# Altium project Counters.PrjPcb
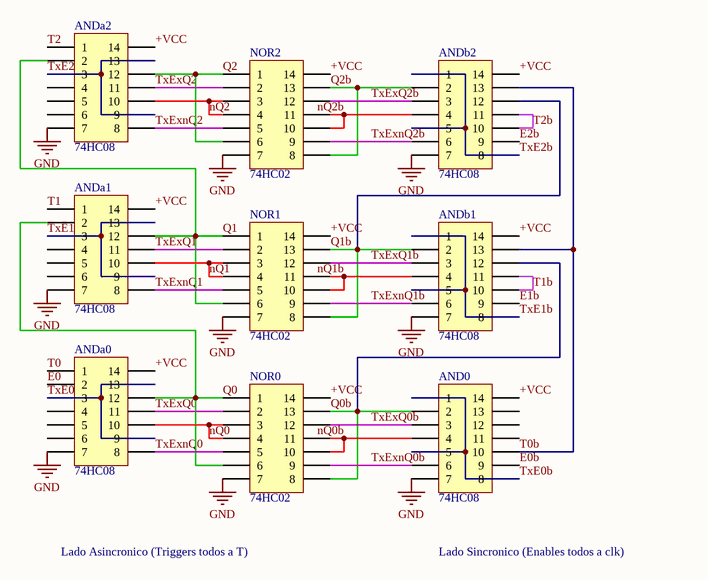
[diagram p0: Counters.SchDoc]
1 sheet, 9 parts. Net scope: global (net labels, ports and power ports of the same name join across sheets).

## Sheet Counters.SchDoc
size A

### Parts
AND0  74HC08  [DIP14]
ANDa0  74HC08  [DIP14]
ANDa1  74HC08  [DIP14]
ANDa2  74HC08  [DIP14]
ANDb1  74HC08  [DIP14]
ANDb2  74HC08  [DIP14]
NOR0  74HC02  [DIP14]
NOR1  74HC02  [DIP14]
NOR2  74HC02  [DIP14]

### Nets
GND: AND0.7 ANDa0.7 ANDa1.7 ANDa2.7 ANDb1.7 ANDb2.7 NOR0.7 NOR1.7 NOR2.7
+VCC: AND0.14 ANDa0.14 ANDa1.14 ANDa2.14 ANDb1.14 ANDb2.14 NOR0.14 NOR1.14 NOR2.14
E0: ANDa0.2
E0b: AND0.9
E1b: ANDb1.9
E2b: ANDb2.9
nQ0: ANDa0.10 NOR0.3 NOR0.4
nQ1: ANDa1.10 NOR1.3 NOR1.4
nQ2: ANDa2.10 NOR2.3 NOR2.4
Q0: ANDa0.12 ANDa1.2 NOR0.1 NOR0.6
Q0b: AND0.2 ANDb1.12 NOR0.8 NOR0.13
Q1: ANDa1.12 ANDa2.2 NOR1.1 NOR1.6
Q1b: ANDb1.2 ANDb2.12 NOR1.8 NOR1.13
Q2: ANDa2.12 NOR2.1 NOR2.6
Q2b: ANDb2.2 NOR2.8 NOR2.13
T0: ANDa0.1
T0b: AND0.10 ANDb1.13 ANDb2.13
T1: ANDa1.1
T1b: ANDb1.10 ANDb1.11
T2: ANDa2.1
T2b: ANDb2.10 ANDb2.11
TxE0: ANDa0.3 ANDa0.9 ANDa0.13
TxE0b: AND0.1 AND0.5 AND0.8
TxE1: ANDa1.3 ANDa1.9 ANDa1.13
TxE1b: ANDb1.1 ANDb1.5 ANDb1.8
TxE2: ANDa2.3 ANDa2.9 ANDa2.13
TxE2b: ANDb2.1 ANDb2.5 ANDb2.8
TxExnQ0: ANDa0.8 NOR0.5
TxExnQ0b: AND0.6 NOR0.9
TxExnQ1: ANDa1.8 NOR1.5
TxExnQ1b: ANDb1.6 NOR1.9
TxExnQ2: ANDa2.8 NOR2.5
TxExnQ2b: ANDb2.6 NOR2.9
TxExQ0: ANDa0.11 NOR0.2
TxExQ0b: AND0.3 NOR0.12
TxExQ1: ANDa1.11 NOR1.2
TxExQ1b: ANDb1.3 NOR1.12
TxExQ2: ANDa2.11 NOR2.2
TxExQ2b: ANDb2.3 NOR2.12
NetAND0_4: AND0.4 NOR0.10 NOR0.11
NetANDb1_4: ANDb1.4 NOR1.10 NOR1.11
NetANDb2_4: ANDb2.4 NOR2.10 NOR2.11

Not connected (* = marked no-connect by the designer): AND0 11 12 13; ANDa0 4 5 6; ANDa1 4 5 6; ANDa2 4 5 6

### Notes on the sheet
- Lado Asincronico (Triggers todos a T)
- Lado Sincronico (Enables todos a clk)
- Labels drawn without touching a wire or pin: nQ0b, nQ1b, nQ2b

### Library data of the parts
AND0 ANDa0-ANDa2 ANDb1 ANDb2 NOR0-NOR2 = IC_DIP14